# EAGLE design adapter (EAGLE 6.5.0)
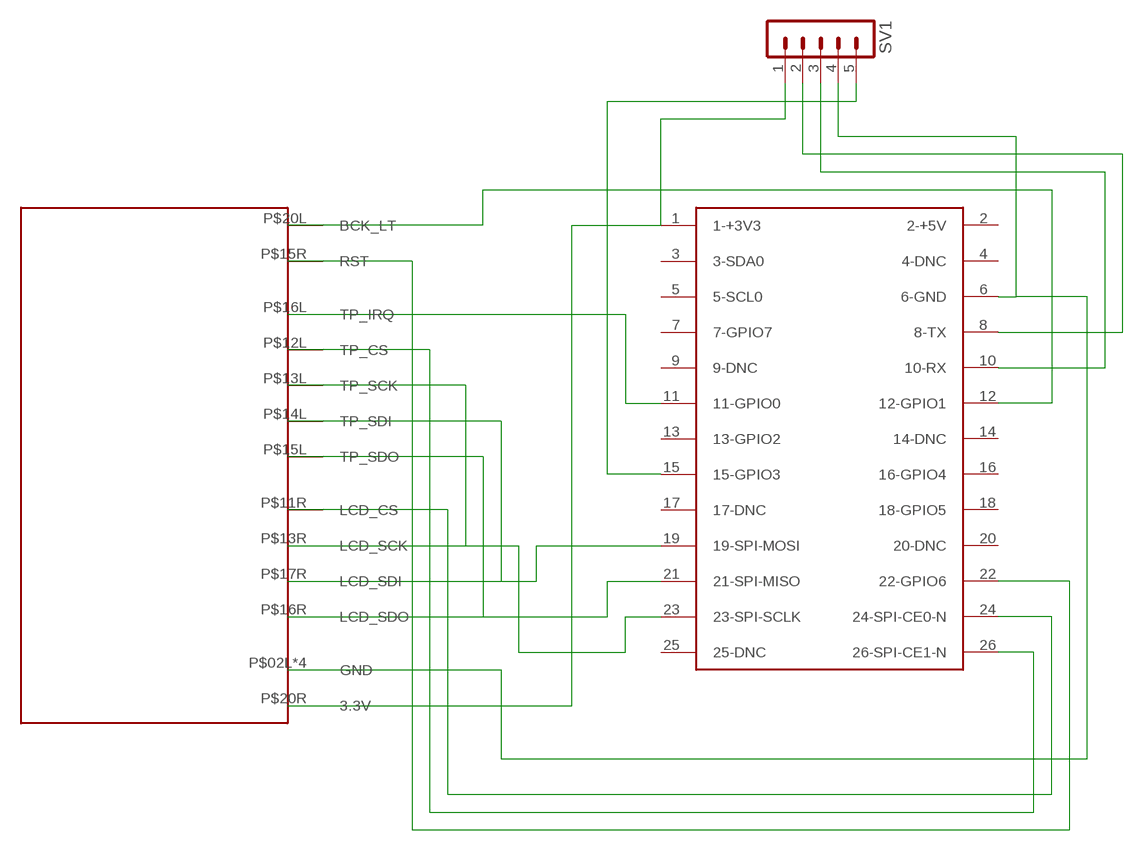
[diagram p0: schematic, sheet 1]

## Parts
SV1  MA05-1  [MA05-1]
U$1  HY28BSTD  [HY28B]
U$2  RASPBERRY-PI  [RASPBERRY-PI]

## Nets
N$1: SV1.1 U$1.P$20R(3.3V) U$2.1(1-+3V3)
N$2: SV1.4 U$1.P$02L(GND) U$1.P$02R(GND) U$1.P$19L(GND) U$1.P$19R(GND) U$2.6(6-GND)
N$3: U$1.P$15L(TP_SDO) U$1.P$16R(LCD_SDO) U$2.21(21-SPI-MISO)
N$4: U$1.P$14L(TP_SDI) U$1.P$17R(LCD_SDI) U$2.19(19-SPI-MOSI)
N$5: U$1.P$13L(TP_SCK) U$1.P$13R(LCD_SCK) U$2.23(23-SPI-SCLK)
N$6: U$1.P$11R(LCD_CS) U$2.24(24-SPI-CE0-N)
N$7: U$1.P$12L(TP_CS) U$2.26(26-SPI-CE1-N)
N$8: U$1.P$16L(TP_IRQ) U$2.11(11-GPIO0)
N$9: U$1.P$20L(BCK_LT) U$2.12(12-GPIO1)
N$10: U$1.P$15R(RST) U$2.22(22-GPIO6)
N$11: SV1.2 U$2.8(8-TX)
N$12: SV1.3 U$2.10(10-RX)
N$13: SV1.5 U$2.15(15-GPIO3)
Unconnected: U$2.2(2-+5V) U$2.3(3-SDA0) U$2.4(4-DNC) U$2.5(5-SCL0) U$2.7(7-GPIO7) U$2.9(9-DNC) U$2.13(13-GPIO2) U$2.14(14-DNC) U$2.16(16-GPIO4) U$2.17(17-DNC) U$2.18(18-GPIO5) U$2.20(20-DNC) U$2.25(25-DNC)

## Library data of the parts
SV1 = con-lstb:MA05-1: PIN HEADER; OC_FARNELL: unknown; OC_NEWARK: unknown
U$1 = hy28b:HY28B
U$2 = RaspberryPi:RASPBERRY-PI: Raspberry Pi Board <http://www.raspberrypi.org/> Jacques Lagnel V1.0 (beta) 2012 Board dimension: Forum 3D model <http://www.raspberrypi.org/forum/general-discussion/mechanical-profile-3d-models?value=3d%20model&type=1&include=1&search=1&ret=all> The GPIO Connector (P1): http://elinux.org/RPi_Low-level_peripherals

## Board
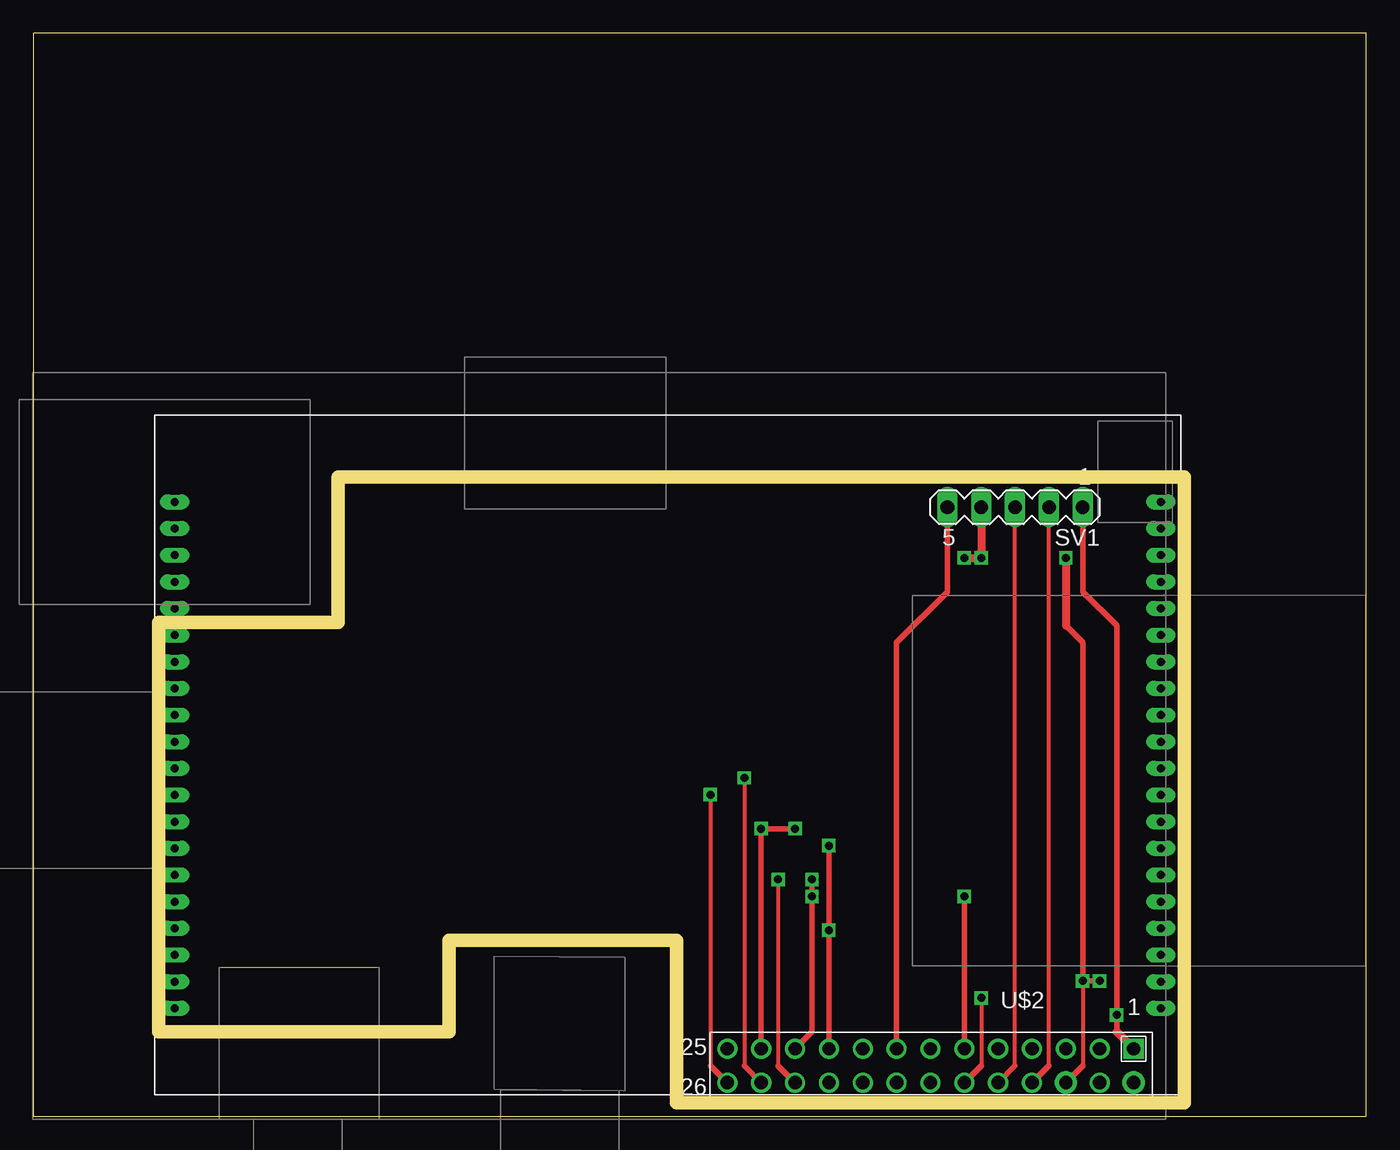
[diagram p1: board, top side]
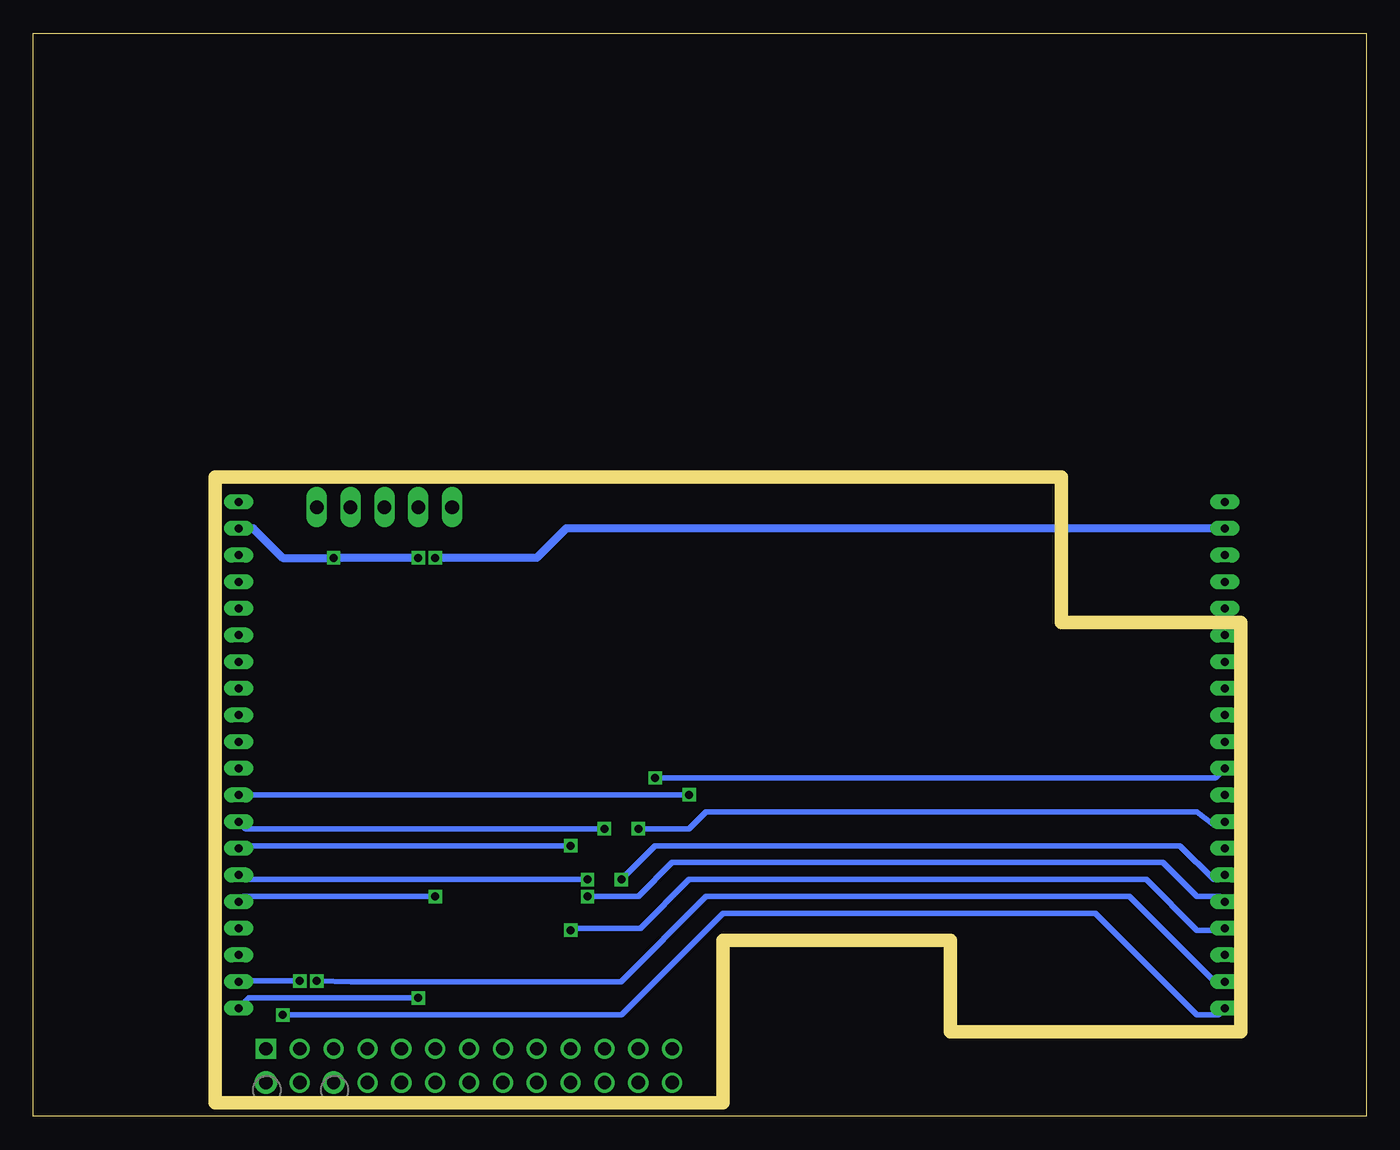
[diagram p2: board, bottom side, seen from below]

Size 100 x 81.27 mm. Coordinates in mm from the lower left corner, seen from the top.
Outline: 0,0 100,0 100,81.27 0,81.27 0,0
Copper layers (1*16): Top 0.035mm / dielectric 1.5mm / Bottom 0.035mm
Design rules "default *": minimum track width 10mil, minimum drill 0.6mm, track to track 8mil, track to pad 8mil, pad to pad 8mil, via to via 8mil, smd to smd 8mil, copper to edge 40mil, drill to drill 8mil, minimum pad ring 10mil, minimum via ring 8mil, stop-mask expansion 4mil, vias tented up to drill 0mil, thermal gap 10mil
Milling: 10 lines

### Footprints (pad centres in the part's own frame; a part is rotated, then mirrored left to right if it is on the bottom)
MA05-1 = drill 1.016 long: 1 -5.08,0; 2 -2.54,0; 3 0,0; 4 2.54,0; 5 5.08,0
HY28B = drill 0.6 long: P$01L 74,38; P$01R 0,38; P$02L 74,36; P$02R 0,36; P$03L 74,34; P$03R 0,34; P$04L 74,32; P$04R 0,32; P$05L 74,30; P$05R 0,30; P$06L 74,28; P$06R 0,28; P$07L 74,26; P$07R 0,26; P$08L 74,24; P$08R 0,24; P$09L 74,22; P$09R 0,22; P$10L 74,20; P$10R 0,20; P$11L 74,18; P$11R 0,18; P$12L 74,16; P$12R 0,16; P$13L 74,14; P$13R 0,14; P$14L 74,12; P$14R 0,12; P$15L 74,10; P$15R 0,10; P$16L 74,8; P$16R 0,8; P$17L 74,6; P$17R 0,6; P$18L 74,4; P$18R 0,4; P$19L 74,2; P$19R 0,2; P$20L 74,0; P$20R 0,0
RASPBERRY-PI = drill 1 square: 1 0,0 | drill 1 pad 1.676: 2 0,2.54; 6 5.08,2.54 | drill 1: 3 2.54,0; 4 2.54,2.54; 5 5.08,0; 7 7.62,0; 8 7.62,2.54; 9 10.16,0; 10 10.16,2.54; 11 12.7,0; 12 12.7,2.54; 13 15.24,0; 14 15.24,2.54; 15 17.78,0; 16 17.78,2.54; 17 20.32,0; 18 20.32,2.54; 19 22.86,0; 20 22.86,2.54; 21 25.4,0; 22 25.4,2.54; 23 27.94,0; 24 27.94,2.54; 25 30.48,0; 26 30.48,2.54

### Placement (x,y rotation side)
SV1  73.66,45.72 180 top
U$1  10.6,8.12 0 top
U$2  82.55,5.08 180 top

### Tracks (layer width: path | path; a pad name or v marks a point on that pad's centre or on a via)
N$1  (via drill 0.6)
  Top 0.406: 81.28,6.35 v81.28,7.62 81.28,36.83 78.74,39.37 SV1.1
  Top 0.61: U$2.1 81.28,6.35
  Bottom 0.406: v81.28,7.62 55.88,7.62 48.26,15.24 20.32,15.24 12.7,7.62 11.1,7.62 U$1.P$20R
N$2  (via drill 0.6)
  Top 0.305: v78.74,10.16 78.74,3.81
  Top 0.406: 78.74,3.81 U$2.6 | v80.01,10.16 v78.74,10.16 78.74,35.56 77.47,36.83
  Top 0.61: v77.47,41.91 77.47,36.83 | SV1.4 v71.12,41.91 v69.85,41.91
  Bottom 0.406: v78.74,10.16 76.16,10.12 55.92,10.12 49.53,16.51 17.78,16.51 11.43,10.16 10.64,10.16 U$1.P$19R | v80.01,10.16 84.56,10.16 U$1.P$19L 84.64,10.16
  Bottom 0.61: U$1.P$02R 60.02,44.12 62.23,41.91 v69.85,41.91 | U$1.P$02L 83.49,44.12 81.28,41.91 v77.47,41.91 v71.12,41.91
N$3  (via drill 0.6)
  Top 0.406: 84.26,17.78 U$1.P$15L | v58.42,17.78 v58.42,16.51 58.42,6.35 U$2.21
  Bottom 0.406: v58.42,17.78 84.26,17.78 U$1.P$15L | v58.42,16.51 54.61,16.51 52.07,19.05 15.24,19.05 12.7,16.51 10.99,16.51 U$1.P$16R
N$4  (via drill 0.6)
  Top 0.406: v59.69,20.32 v59.69,13.97 U$2.19
  Bottom 0.406: v59.69,20.32 84.4,20.32 U$1.P$14L | v59.69,13.97 59.54,14.12 54.46,14.12 50.8,17.78 16.51,17.78 12.7,13.97 10.75,13.97 U$1.P$17R
N$5  (via drill 0.6)
  Top 0.406: U$2.23 v54.61,21.59 v57.15,21.59
  Bottom 0.406: v57.15,21.59 84.07,21.59 U$1.P$13L | v54.61,21.59 50.8,21.59 49.53,22.86 12.7,22.86 11.43,21.89 10.83,21.89 U$1.P$13R
N$6  (via drill 0.6)
  Top 0.305: v53.34,25.4 53.34,3.81
  Top 0.406: U$2.24 53.34,3.81
  Bottom 0.406: v53.34,25.4 11.32,25.4 U$1.P$11R
N$7  (via drill 0.6)
  Top 0.305: v50.8,24.13 50.8,3.81
  Top 0.406: U$2.26 50.8,3.81
  Bottom 0.406: v50.8,24.13 U$1.P$12L
N$8  (via drill 0.6)
  Top 0.406: U$2.11 v69.85,16.51
  Bottom 0.406: v69.85,16.51 84.21,16.51 U$1.P$16L
N$9  (via drill 0.6)
  Top 0.305: v71.12,8.89 71.12,3.81
  Top 0.406: U$2.12 71.12,3.81
  Bottom 0.406: v71.12,8.89 83.83,8.89 U$1.P$20L
N$10  (via drill 0.6)
  Top 0.305: v55.88,17.78 55.88,3.81
  Top 0.406: U$2.22 55.88,3.81
  Bottom 0.406: v55.88,17.78 53.34,20.32 13.97,20.32 11.43,17.78 10.94,17.78 U$1.P$15R
N$11
  Top 0.305: 76.2,3.81 SV1.2
  Top 0.406: U$2.8 76.2,3.81
N$12
  Top 0.305: 73.66,3.81 SV1.3
  Top 0.406: U$2.10 73.66,3.81
N$13
  Top 0.406: SV1.5 68.58,39.37 64.77,35.56 U$2.15